# Altium schematic sheet [04] - CPU - SIGNAL, USB, JTAG.SchDoc: DOCUMENT TITLE
size A4; Organization: Tor Brodtkorb; Address1: Frode Rinnans veg 193; Address2: 7050 Trondheim; DocumentNumber: 6598; Revision: 1.0; SheetNumber: 1; SheetTotal: 1
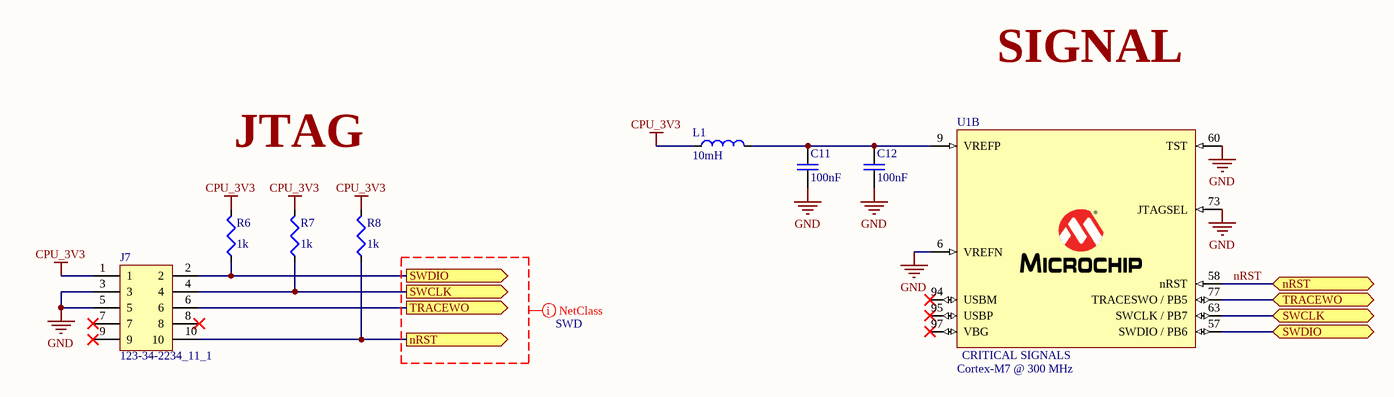
[diagram p0: [04] - CPU - SIGNAL, USB, JTAG.SchDoc]

## Parts
C11  value 100nF  [C0603]  (hidden comment: 02016D104KAT2A)
C12  value 100nF  [C0603]  (hidden comment: 02016D104KAT2A)
J7  123-34-2234_11_1  [Header 2x5 male 1.27mm]
L1  value 10mH  [Inductor 0603]  (hidden comment: MLZ1608A2R2WT)
R6  value 1k  [R0603]  (hidden comment: CPF-A-0603B100KE1)
R7  value 1k  [R0603]  (hidden comment: CPF-A-0603B100KE1)
R8  value 1k  [R0603]  (hidden comment: CPF-A-0603B100KE1)
U1  Cortex-M7 @ 300 MHz  [ATSAMS70N19A-AN]  (part B of 3)

## Ports
nRST (bidir), nRST (out), SWCLK (bidir), SWCLK (out), SWDIO (bidir), SWDIO (out), TRACEWO (bidir), TRACEWO (out)

## Nets
CPU_3V3: J7.1 L1.1 R6.2 R7.2 R8.2
GND: C11.1 C12.1 J7.3 J7.5 U1.6(VREFN) U1.60(TST) U1.73(JTAGSEL)
nRST: J7.10 R8.1 U1.58(nRST) ; port nRST
SWCLK: J7.4 R7.1 U1.63(SWCLK_/_PB7) ; port SWCLK
SWDIO: J7.2 R6.1 U1.57(SWDIO_/_PB6) ; port SWDIO
TRACEWO: J7.6 U1.77(TRACESWO_/_PB5) ; port TRACEWO
NetC11_2: C11.2 C12.2 L1.2 U1.9(VREFP)

Not connected (* = marked no-connect by the designer): J7 7* 8* 9*; U1 94(USBM)* 95(USBP)* 97(VBG)*

## Layout directives
net class SWD: (no net found under the mark)

## Notes on the sheet
- SIGNAL
- JTAG
- Title
- Size:
- Date:
- A4
- Number:
- Time:
- Revision:
- Sheet
- of
- File:
- (in symbol ATSAMS70N19A-AN, part B) CRITICAL SIGNALS

## Library data of the parts
C11 C12 = 02016D104KAT2A: C0603
J7 = 123-34-2234_11_1: Header 2x5 male 1.27mm
L1 = MLZ1608A2R2WT: Inductor 0603
R6-R8 = CPF-A-0603B100KE1: R0603
U1 = ATSAMS70N19A-AN: ATSAMS70N19; Supplier Part Number 1: 2484390; Supplier 1: Farnell